# Altium schematic sheet DM9000.SchDoc
size A
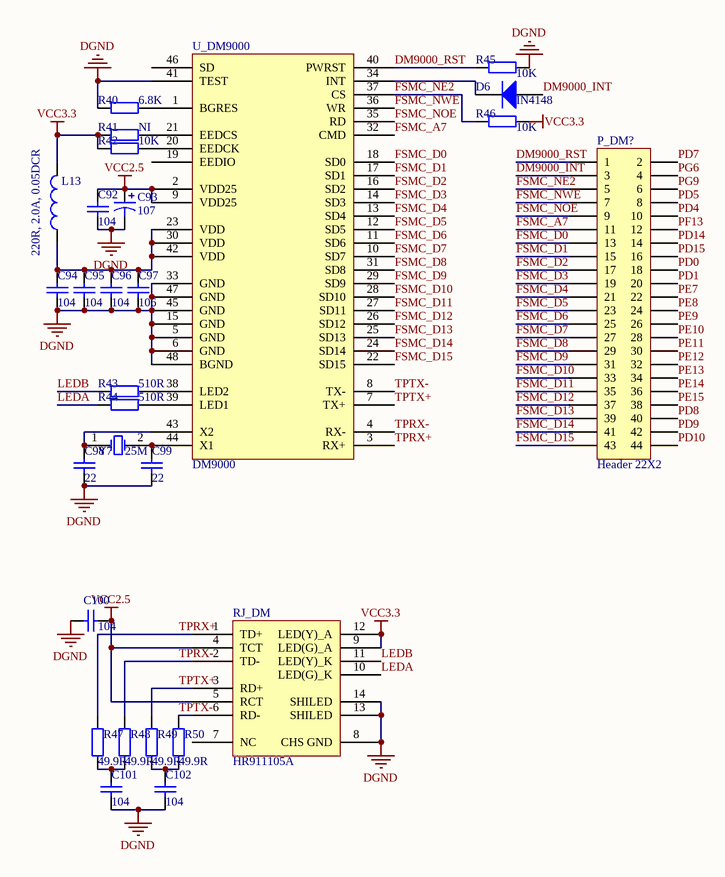
[diagram p0: DM9000.SchDoc]

## Parts
C92  value 104  [SMT-0603]  (hidden comment: Cap)
C93  value 107  [SMT-Cap100~220uF(5x5.4)_10V]  (hidden comment: Cap Pol1)
C94  value 104  [SMT-0603]  (hidden comment: Cap)
C95  value 104  [SMT-0603]  (hidden comment: Cap)
C96  value 104  [SMT-0603]  (hidden comment: Cap)
C97  value 106  [SMT-0603]  (hidden comment: Cap)
C98  value 22  [SMT-0603]  (hidden comment: Cap)
C99  value 22  [SMT-0603]  (hidden comment: Cap)
C100  value 104  [SMT-0603]  (hidden comment: Cap)
C101  value 104  [SMT-0603]  (hidden comment: Cap)
C102  value 104  [SMT-0603]  (hidden comment: Cap)
D6  IN4148  [SMA]
L13  value 220R, 2.0A, 0.05DCR  [SMT-0603]  (hidden comment: Inductor)
P_DM?  Header 22X2  [HDR2X22]
R40  value 6.8K  [SMT-0603]  (hidden comment: Res2)
R41  value NI  [SMT-0603]  (hidden comment: Res2)
R42  value 10K  [SMT-0603]  (hidden comment: Res2)
R43  value 510R  [SMT-0603]  (hidden comment: Res2)
R44  value 510R  [SMT-0603]  (hidden comment: Res2)
R45  value 10K  [SMT-0603]  (hidden comment: Res2)
R46  value 10K  [SMT-0603]  (hidden comment: Res2)
R47  value 49.9R  [SMT-0603]  (hidden comment: Res2)
R48  value 49.9R  [SMT-0603]  (hidden comment: Res2)
R49  value 49.9R  [SMT-0603]  (hidden comment: Res2)
R50  value 49.9R  [SMT-0603]  (hidden comment: Res2)
RJ_DM  HR911105A  [RJ45-LED]
U_DM9000  DM9000
Y7  25M  [D-CRYSTAL_UPRIGHT]

## Nets
DGND: C92.1 C93.2 C94.1 C95.1 C96.1 C97.1 C98.1 C99.1 C100.1 C101.1 C102.1 R40.1 R45.2 RJ_DM.8(CHS_GND) RJ_DM.13(SHILED) RJ_DM.14(SHILED) U_DM9000.5(GND) U_DM9000.6(GND) U_DM9000.15(GND) U_DM9000.33(GND) U_DM9000.41(TEST) U_DM9000.45(GND) U_DM9000.47(GND) U_DM9000.48(BGND)
VCC2.5: C92.2 C93.1 C100.2 RJ_DM.4(TCT) RJ_DM.5(RCT) U_DM9000.2(VDD25) U_DM9000.9(VDD25)
VCC3.3: L13.2 R41.1 R42.1 R46.2 RJ_DM.9(LED(G)_A) RJ_DM.12(LED(Y)_A)
DM9000_INT: D6.1(A) P_DM?.3
DM9000_RST: P_DM?.1 R45.1 U_DM9000.40(PWRST)
FSMC_A7: P_DM?.11 U_DM9000.32(CMD)
FSMC_D0: P_DM?.13 U_DM9000.18(SD0)
FSMC_D1: P_DM?.15 U_DM9000.17(SD1)
FSMC_D2: P_DM?.17 U_DM9000.16(SD2)
FSMC_D3: P_DM?.19 U_DM9000.14(SD3)
FSMC_D4: P_DM?.21 U_DM9000.13(SD4)
FSMC_D5: P_DM?.23 U_DM9000.12(SD5)
FSMC_D6: P_DM?.25 U_DM9000.11(SD6)
FSMC_D7: P_DM?.27 U_DM9000.10(SD7)
FSMC_D8: P_DM?.29 U_DM9000.31(SD8)
FSMC_D9: P_DM?.31 U_DM9000.29(SD9)
FSMC_D10: P_DM?.33 U_DM9000.28(SD10)
FSMC_D11: P_DM?.35 U_DM9000.27(SD11)
FSMC_D12: P_DM?.37 U_DM9000.26(SD12)
FSMC_D13: P_DM?.39 U_DM9000.25(SD13)
FSMC_D14: P_DM?.41 U_DM9000.24(SD14)
FSMC_D15: P_DM?.43 U_DM9000.22(SD15)
FSMC_NE2: P_DM?.5 R46.1 U_DM9000.37(CS)
FSMC_NOE: P_DM?.9 U_DM9000.35(RD)
FSMC_NWE: P_DM?.7 U_DM9000.36(WR)
LEDA: R44.1 RJ_DM.10(LED(G)_K)
LEDB: R43.1 RJ_DM.11(LED(Y)_K)
PD0: P_DM?.18
PD1: P_DM?.20
PD4: P_DM?.10
PD5: P_DM?.8
PD7: P_DM?.2
PD8: P_DM?.40
PD9: P_DM?.42
PD10: P_DM?.44
PD14: P_DM?.14
PD15: P_DM?.16
PE7: P_DM?.22
PE8: P_DM?.24
PE9: P_DM?.26
PE10: P_DM?.28
PE11: P_DM?.30
PE12: P_DM?.32
PE13: P_DM?.34
PE14: P_DM?.36
PE15: P_DM?.38
PF13: P_DM?.12
PG6: P_DM?.4
PG9: P_DM?.6
TPRX+: R47.2 RJ_DM.1(TD+) U_DM9000.3(RX+)
TPRX-: R48.2 RJ_DM.2(TD-) U_DM9000.4(RX-)
TPTX+: R49.2 RJ_DM.3(RD+) U_DM9000.7(TX+)
TPTX-: R50.2 RJ_DM.6(RD-) U_DM9000.8(TX-)
NetC94_2: C94.2 C95.2 C96.2 C97.2 L13.1 U_DM9000.23(VDD) U_DM9000.30(VDD) U_DM9000.42(VDD)
NetC98_2: C98.2 U_DM9000.43(X2) Y7.1(OSC1)
NetC99_2: C99.2 U_DM9000.44(X1) Y7.2(OSC2)
NetC101_2: C101.2 R47.1 R48.1
NetC102_2: C102.2 R49.1 R50.1
NetD6_2: D6.2(K) U_DM9000.34(INT)
NetR40_2: R40.2 U_DM9000.1(BGRES)
NetR41_2: R41.2 U_DM9000.21(EEDCS)
NetR42_2: R42.2 U_DM9000.20(EEDCK)
NetR43_2: R43.2 U_DM9000.38(LED2)
NetR44_2: R44.2 U_DM9000.39(LED1)

Not connected (* = marked no-connect by the designer): RJ_DM 7(NC); U_DM9000 19(EEDIO) 46(SD)

## Library data of the parts
C92 C94-C102 = Cap: Capacitor; Published: 8-Jun-2000; LatestRevisionDate: 17-Jul-2002; LatestRevisionNote: Re-released for DXP Platform.; PackageReference: RAD-0.3; Publisher: Altium Limited; PackageDescription: Radial Cap, Thru-Hole; 2 Leads; 0.3 in Pin Spacing
C93 = Cap Pol1: Polarized Capacitor (Radial); Published: 8-Jun-2000; LatestRevisionDate: 17-Jul-2002; LatestRevisionNote: Re-released for DXP Platform.; PackageReference: RB7.6-15; Publisher: Altium Limited; PackageDescription: Polarized Capacitor (Radial); 2 Leads
D6 = Diode 1N5400: 3 Amp General Purpose Rectifier; Published: 8-Jun-2000; LatestRevisionDate: 17-Jul-2002; LatestRevisionNote: Re-released for DXP Platform.; DatasheetVersion: 1998; PackageVersion: Aug-1999; PackageReference: DO-201AD; Publisher: Altium Limited; PackageDescription: Diode, Axial; Body 9.5 x 5.6 mm (LxDia. max), Lead Dia. 1.32 mm (max); ComponentLink1Description: Manufacturer Link; ComponentLink1URL: http://www.fairchildsemi.com/; ComponentLink2Description: Datasheet; ComponentLink2URL: http://www.fairchildsemi.com/ds/1N%2F1N5400.pdf
L13 = Inductor: Code_IEC: 1005; Published: 8-Jun-2000; LatestRevisionDate: 29-May-2009; LatestRevisionNote: IPC-7351 Footprint Added.; PackageReference: 0402-A; Publisher: Altium Limited; PackageDescription: Chip Inductor; Code_JEITA: 0402
P_DM? = Header 22X2: Header, 22-Pin, Dual row; LatestRevisionDate: 17-Jul-2002; LatestRevisionNote: Re-released for DXP Platform.; Publisher: Altium Limited
R40-R50 = Res2: Resistor; Published: 8-Jun-2000; LatestRevisionDate: 17-Jul-2002; LatestRevisionNote: Re-released for DXP Platform.; PackageReference: AXIAL-0.4; Publisher: Altium Limited; PackageDescription: Axial Device, Thru-Hole; 2 Leads; 0.4 in Pin Spacing
RJ_DM = RJ45
Y7 = XTAL: Crystal Oscillator; Published: 8-Jun-2000; LatestRevisionDate: 17-Jul-2002; LatestRevisionNote: Re-released for DXP Platform.; PackageReference: R38; Publisher: Altium Limited; PackageDescription: Crystal, Thru-Hole; 2 Leads; Body 3.1 x 8.2 mm (Dia.xH)